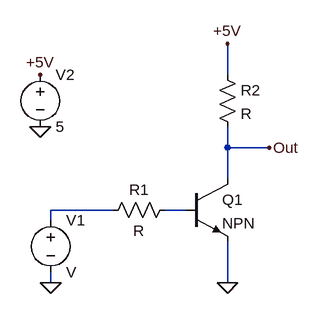
[diagram p0: schematic RTL.asc]
RTL.asc, the LTspice schematic file:
Version 4
SHEET 1 880 680
WIRE 176 -64 176 -112
WIRE 176 48 176 16
WIRE 240 48 176 48
WIRE 176 96 176 48
WIRE 0 144 -96 144
WIRE 112 144 80 144
WIRE -96 160 -96 144
WIRE -96 256 -96 240
WIRE 176 256 176 192
FLAG 176 256 0
FLAG 176 -112 +5V
FLAG 240 48 Out
FLAG -96 256 0
FLAG -112 16 0
FLAG -112 -64 +5V
SYMBOL res 96 128 R90
WINDOW 0 0 56 VBottom 2
WINDOW 3 32 56 VTop 2
SYMATTR InstName R1
SYMBOL npn 112 96 R0
SYMATTR InstName Q1
SYMBOL res 160 -80 R0
SYMATTR InstName R2
SYMBOL voltage -96 144 R0
SYMATTR InstName V1
SYMBOL voltage -112 -80 R0
WINDOW 123 0 0 Left 0
WINDOW 39 0 0 Left 0
SYMATTR InstName V2
SYMATTR Value 5

The netlist it stands for:
* RTL.asc
R1 N002 N001 R
Q1 Out N002 0 0 NPN
R2 +5V Out R
V1 N001 0 V
V2 +5V 0 5
.model NPN NPN
.model PNP PNP
.lib standard.bjt
.backanno
.end